# EasyEDA schematic SCH_TwoStep-OPEN-SOURCE_2024-09-30.json

## Sheets
1 Outputs: TITLE: Sheet_2; REV: 1.0; Date: 2022-02-27; Sheet: 1/1; Drawn By: Norman Alphaspeed; Company: Your Company
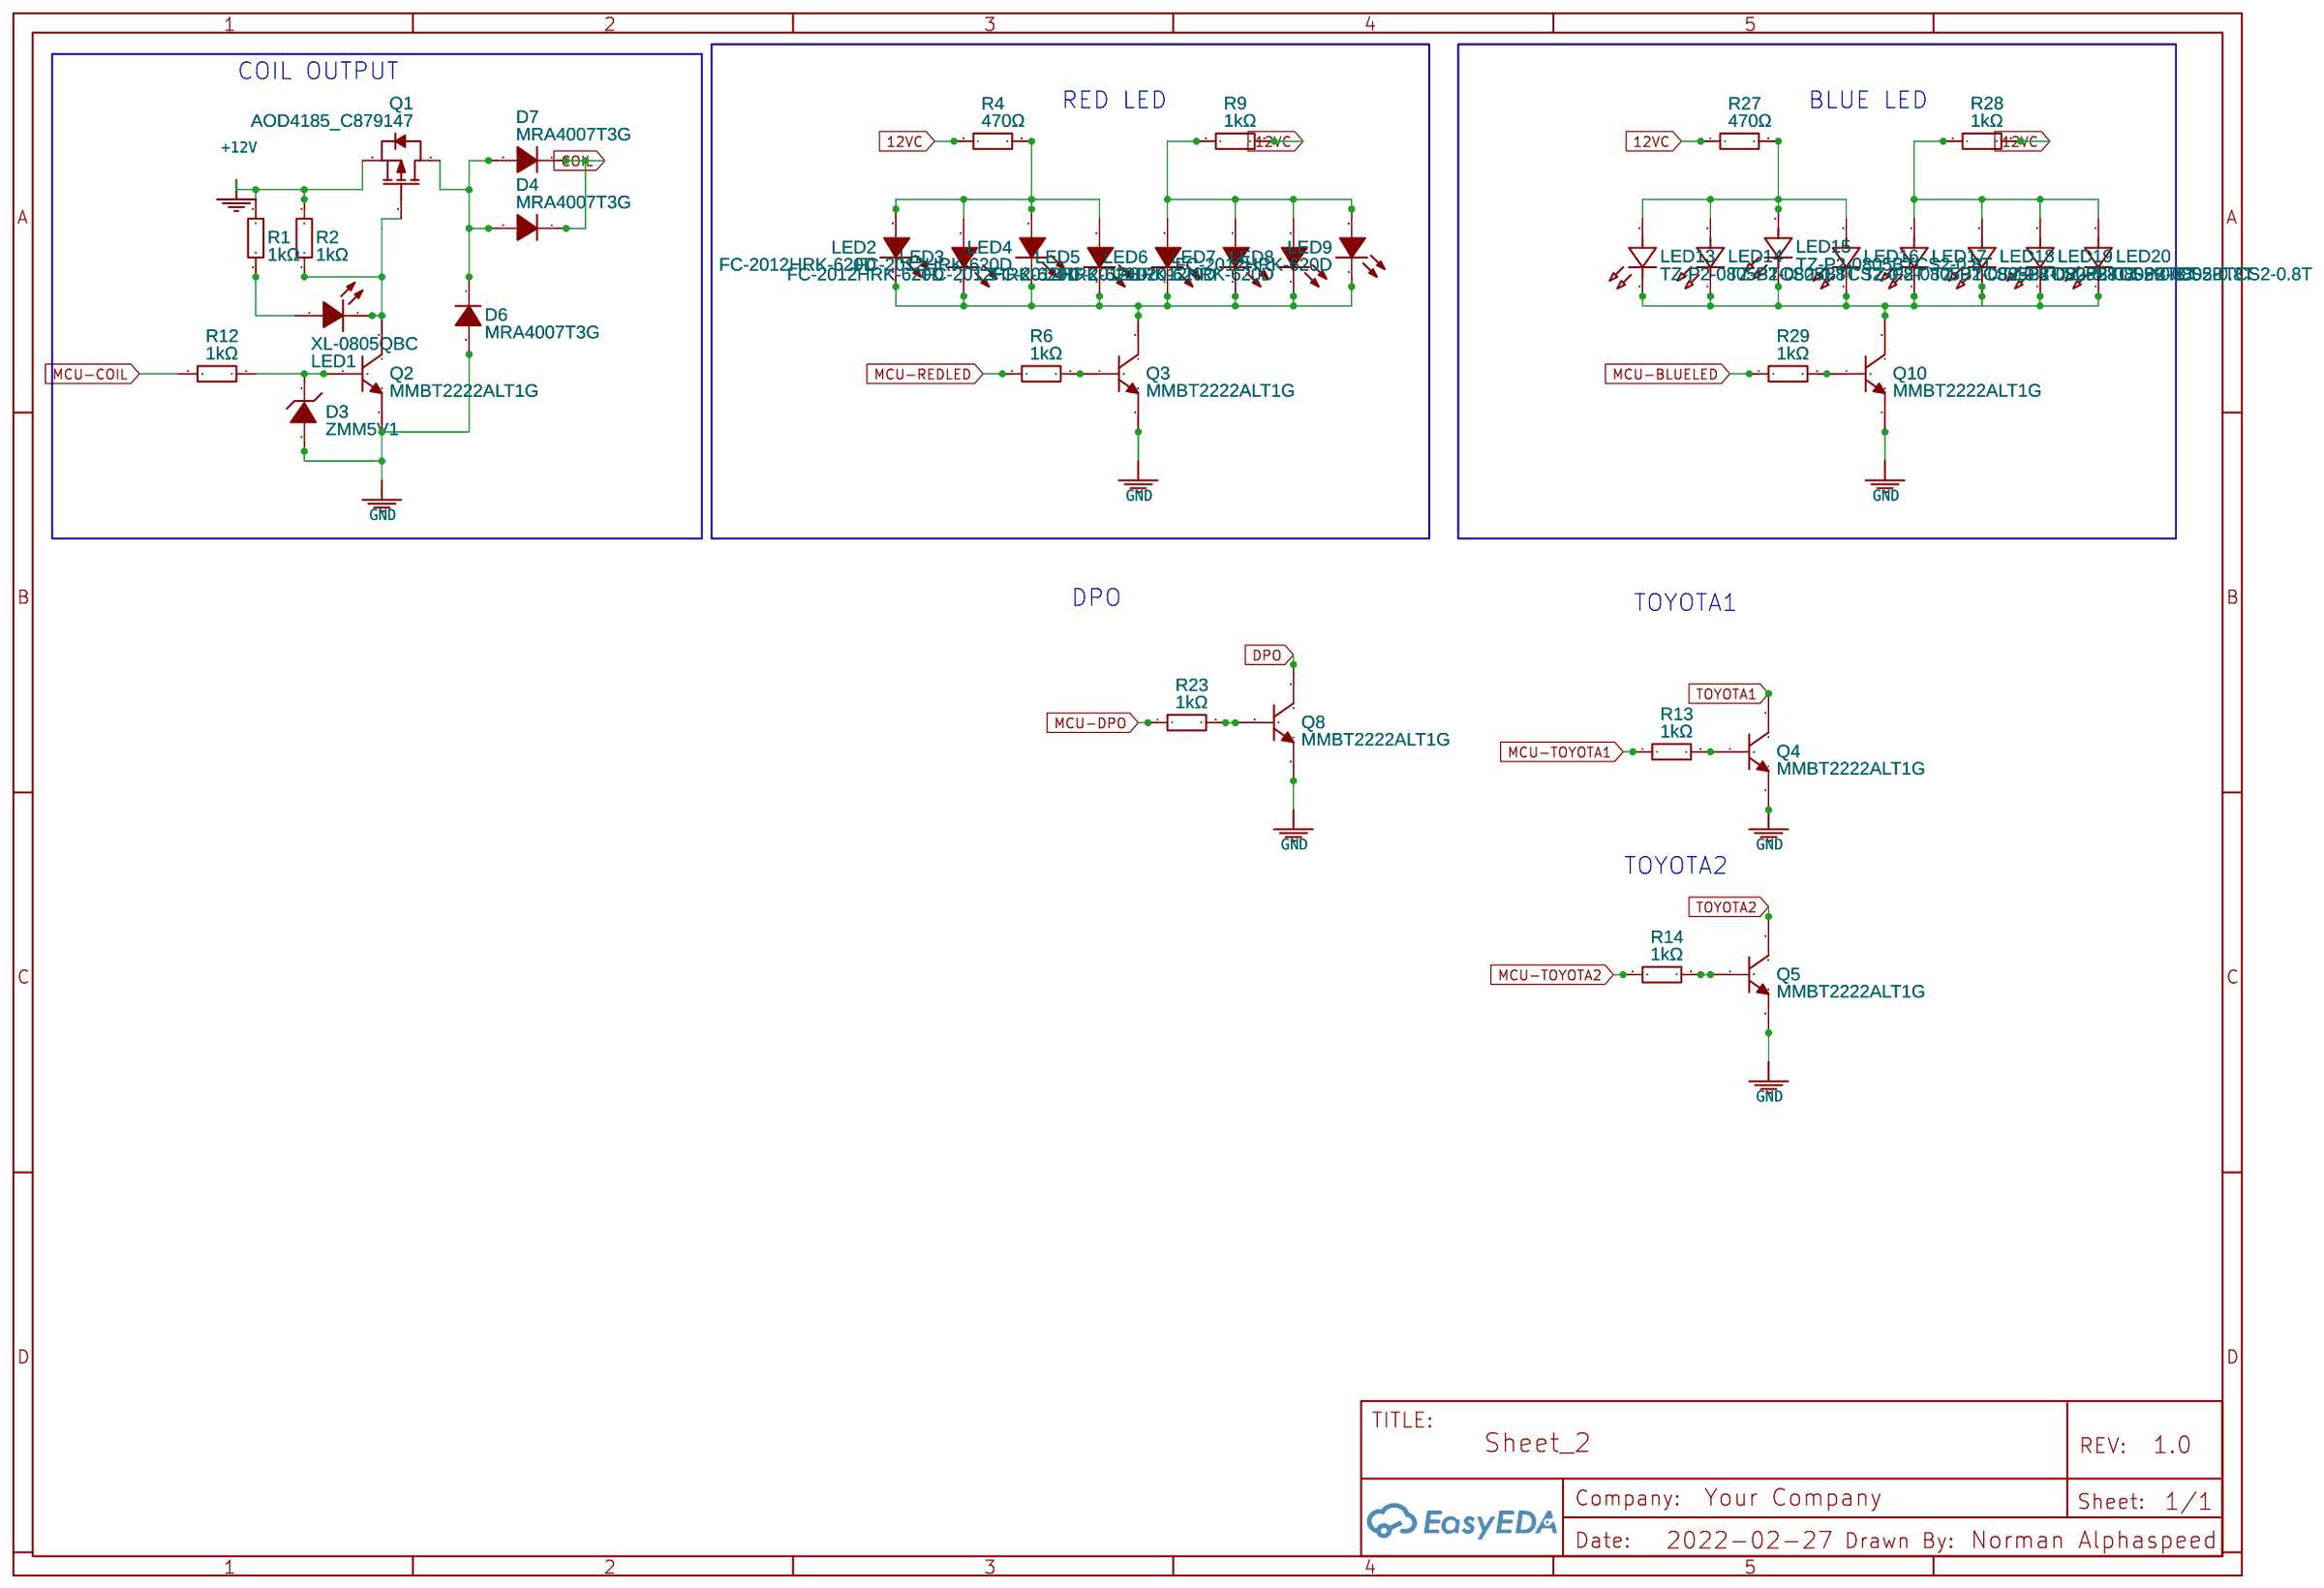
[diagram p0: Outputs]
2 Inputs: TITLE: Inputs
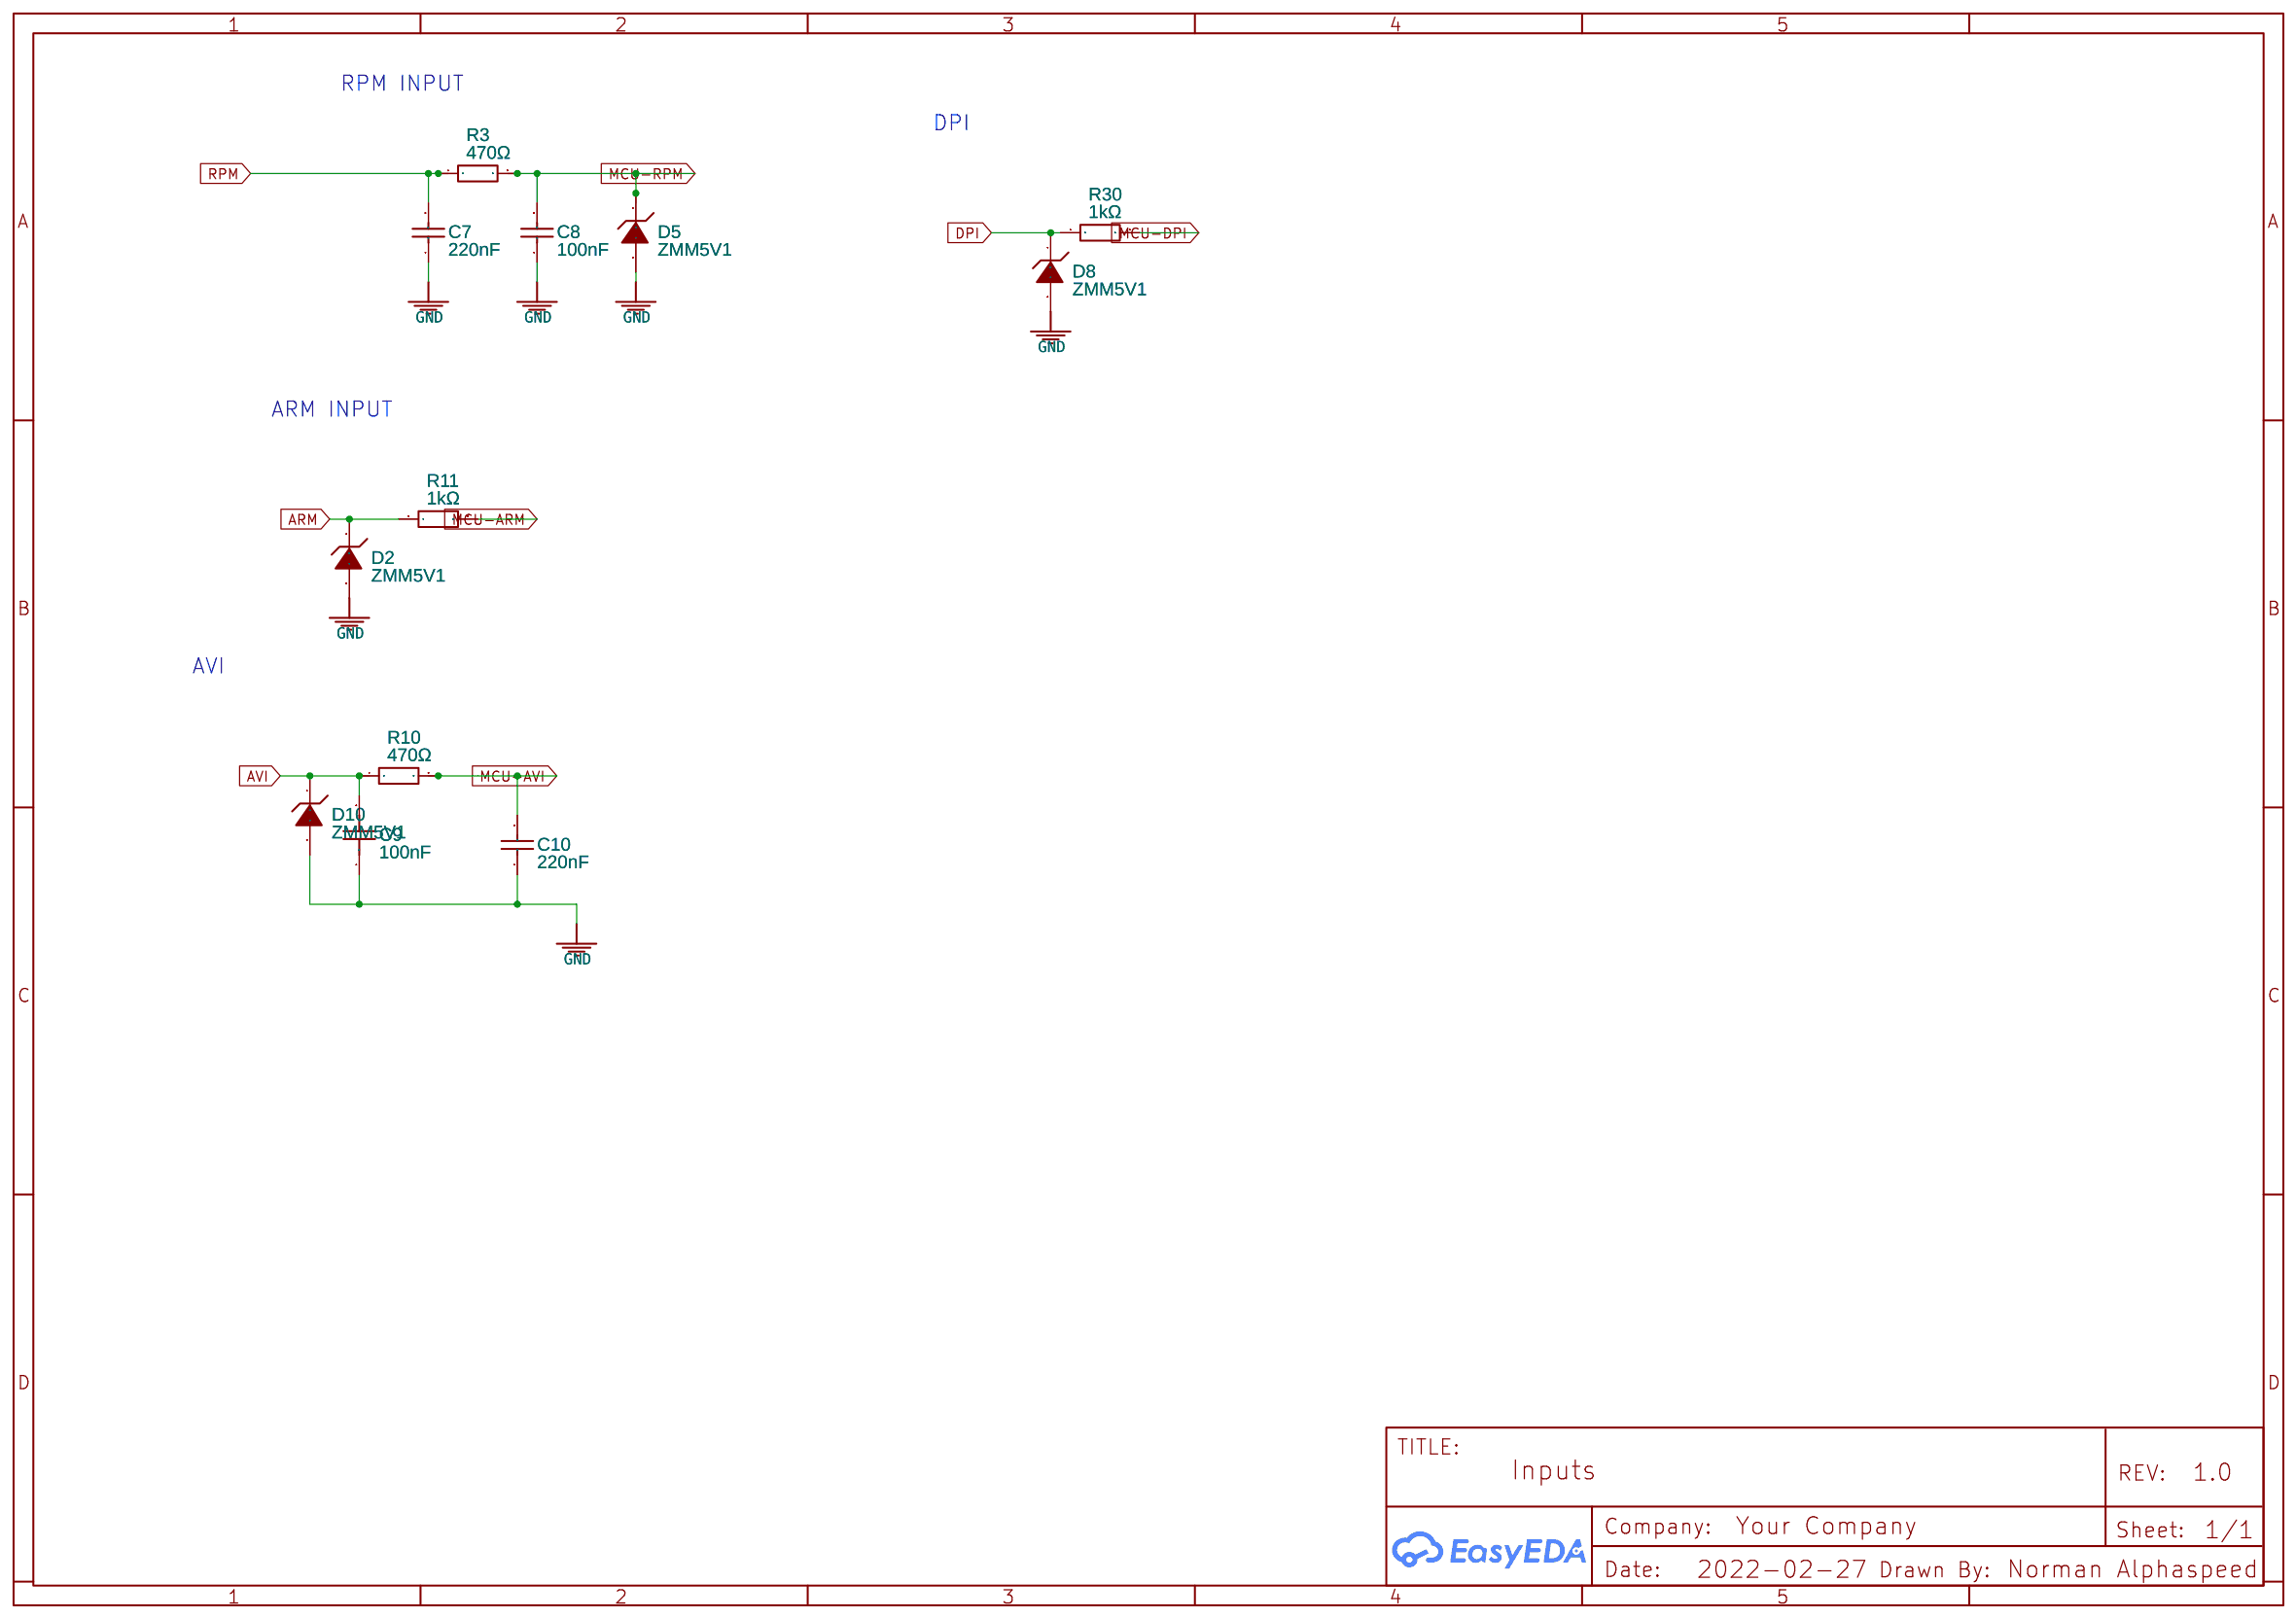
[diagram p1: Inputs]
3 MCU: TITLE: Sheet_1
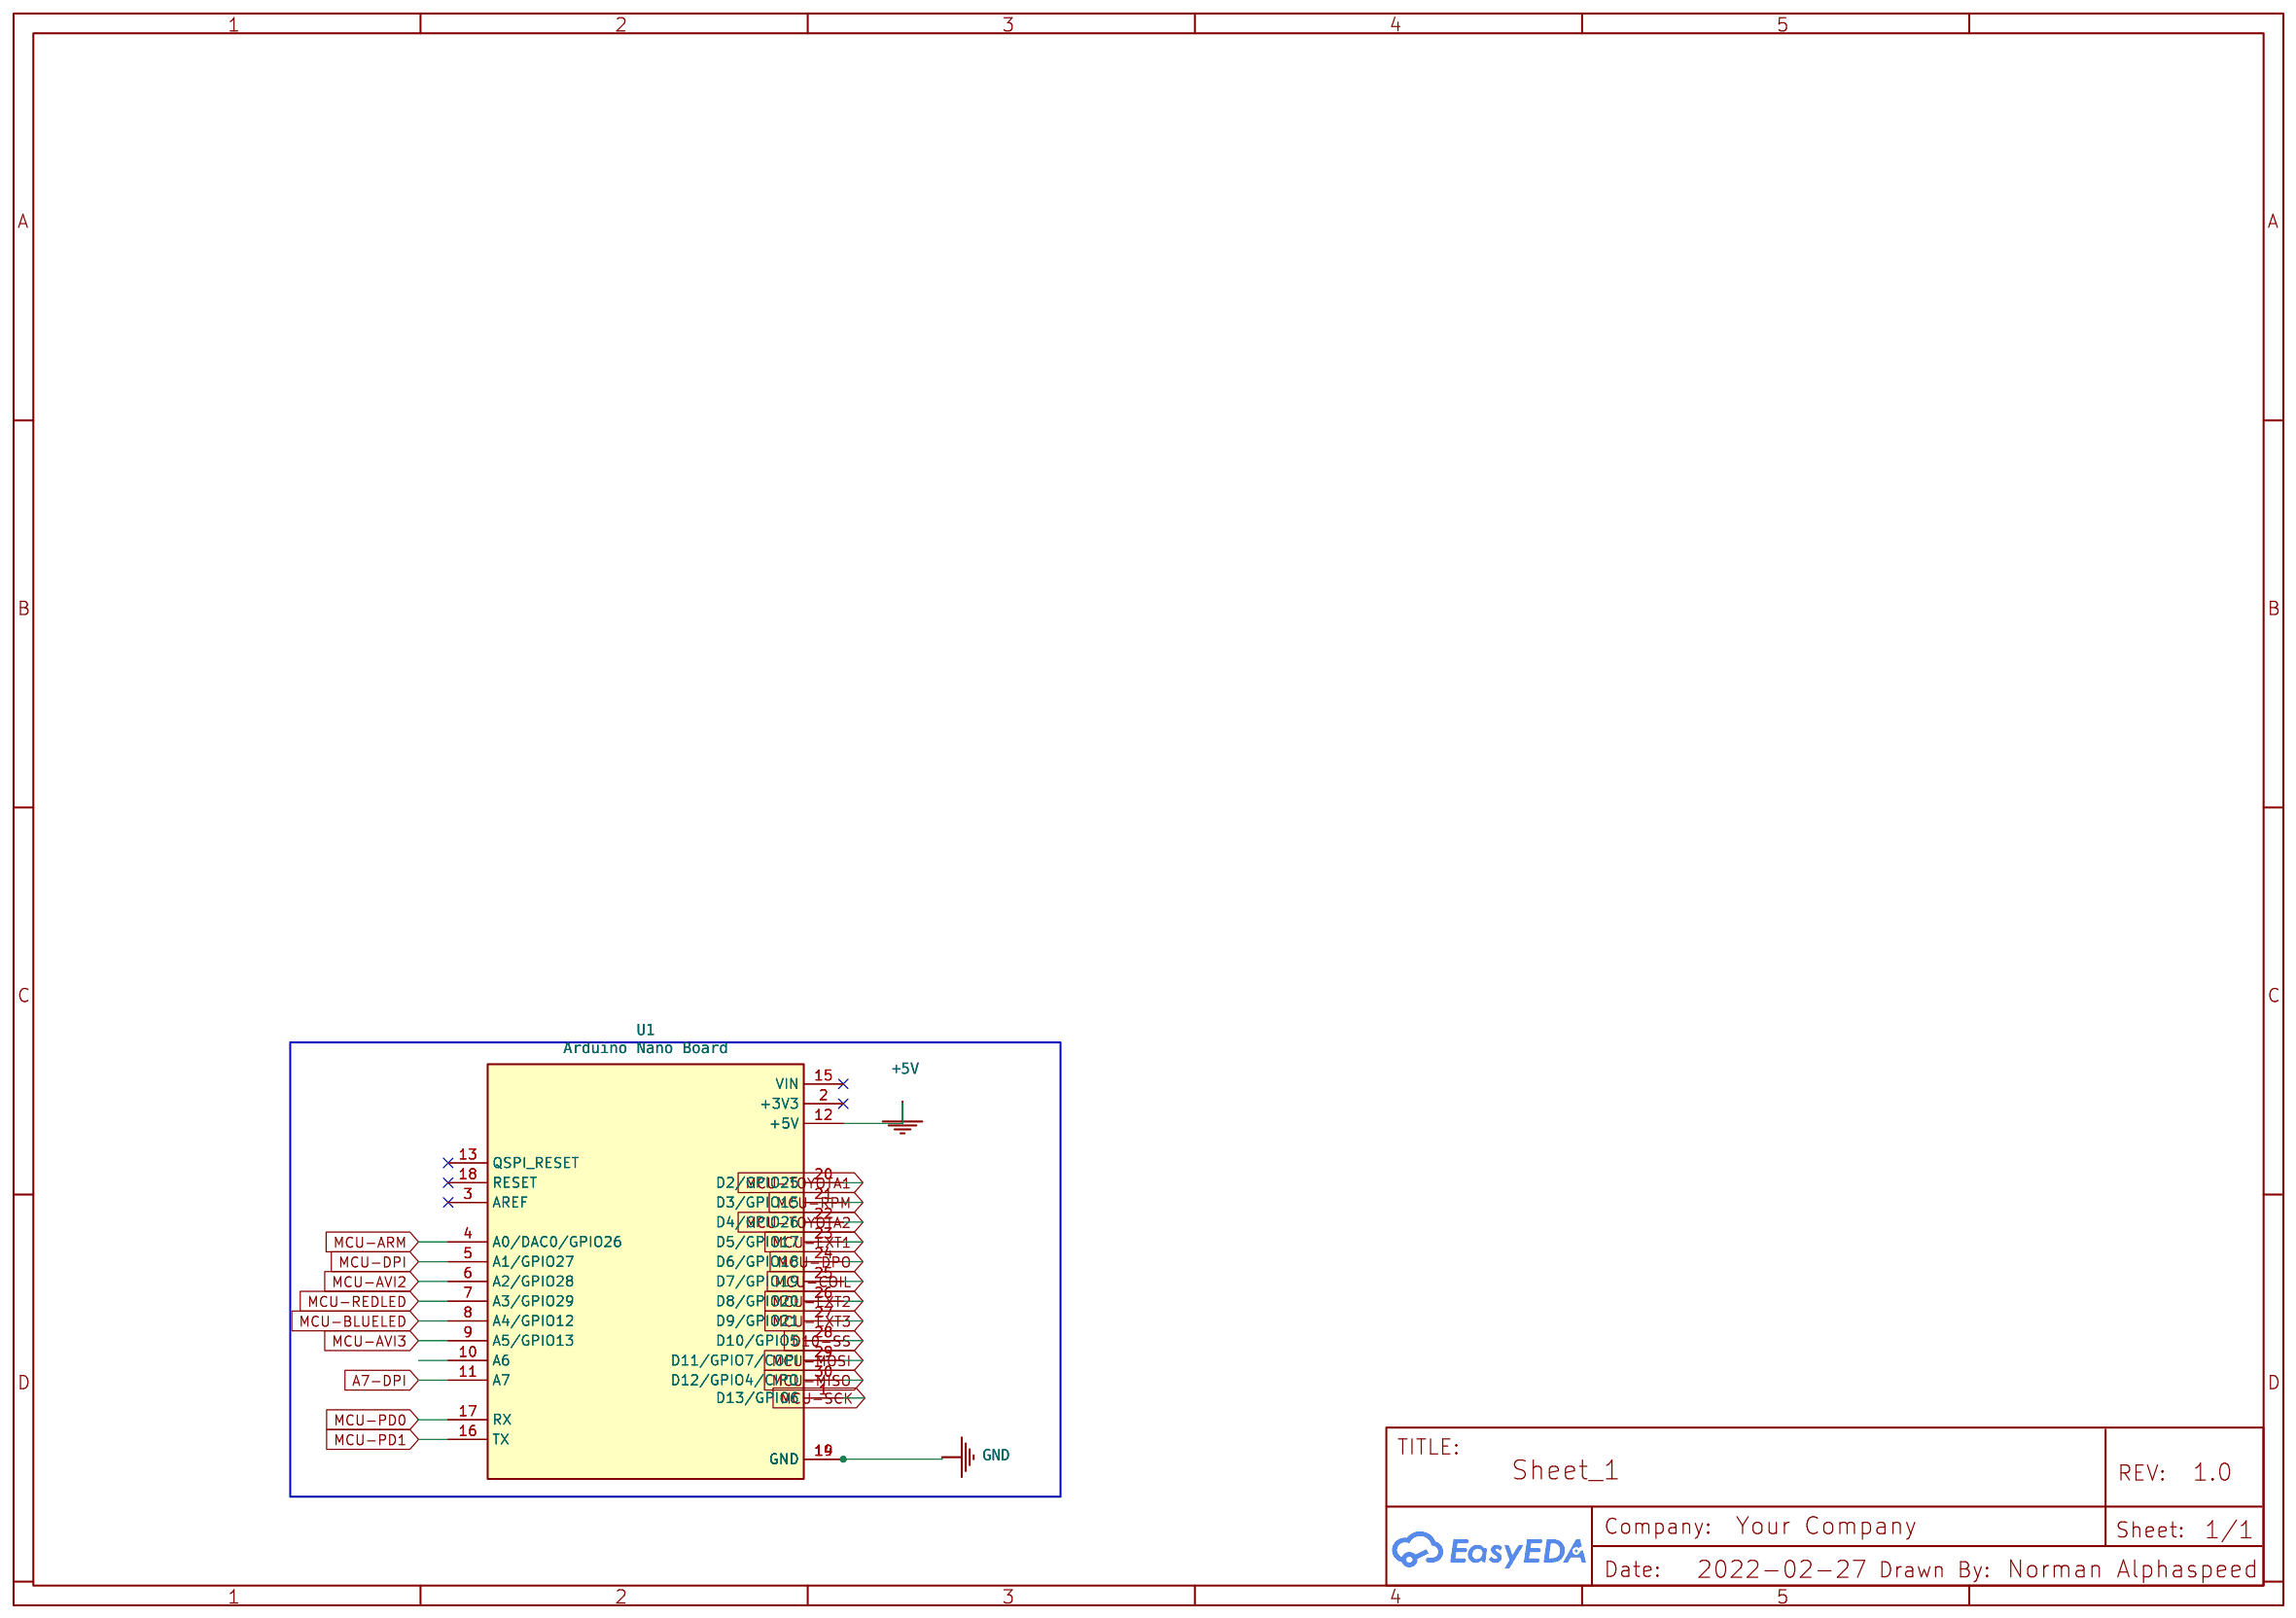
[diagram p2: MCU]
4 Comms: TITLE: Sheet_1; Date: 2022-02-28
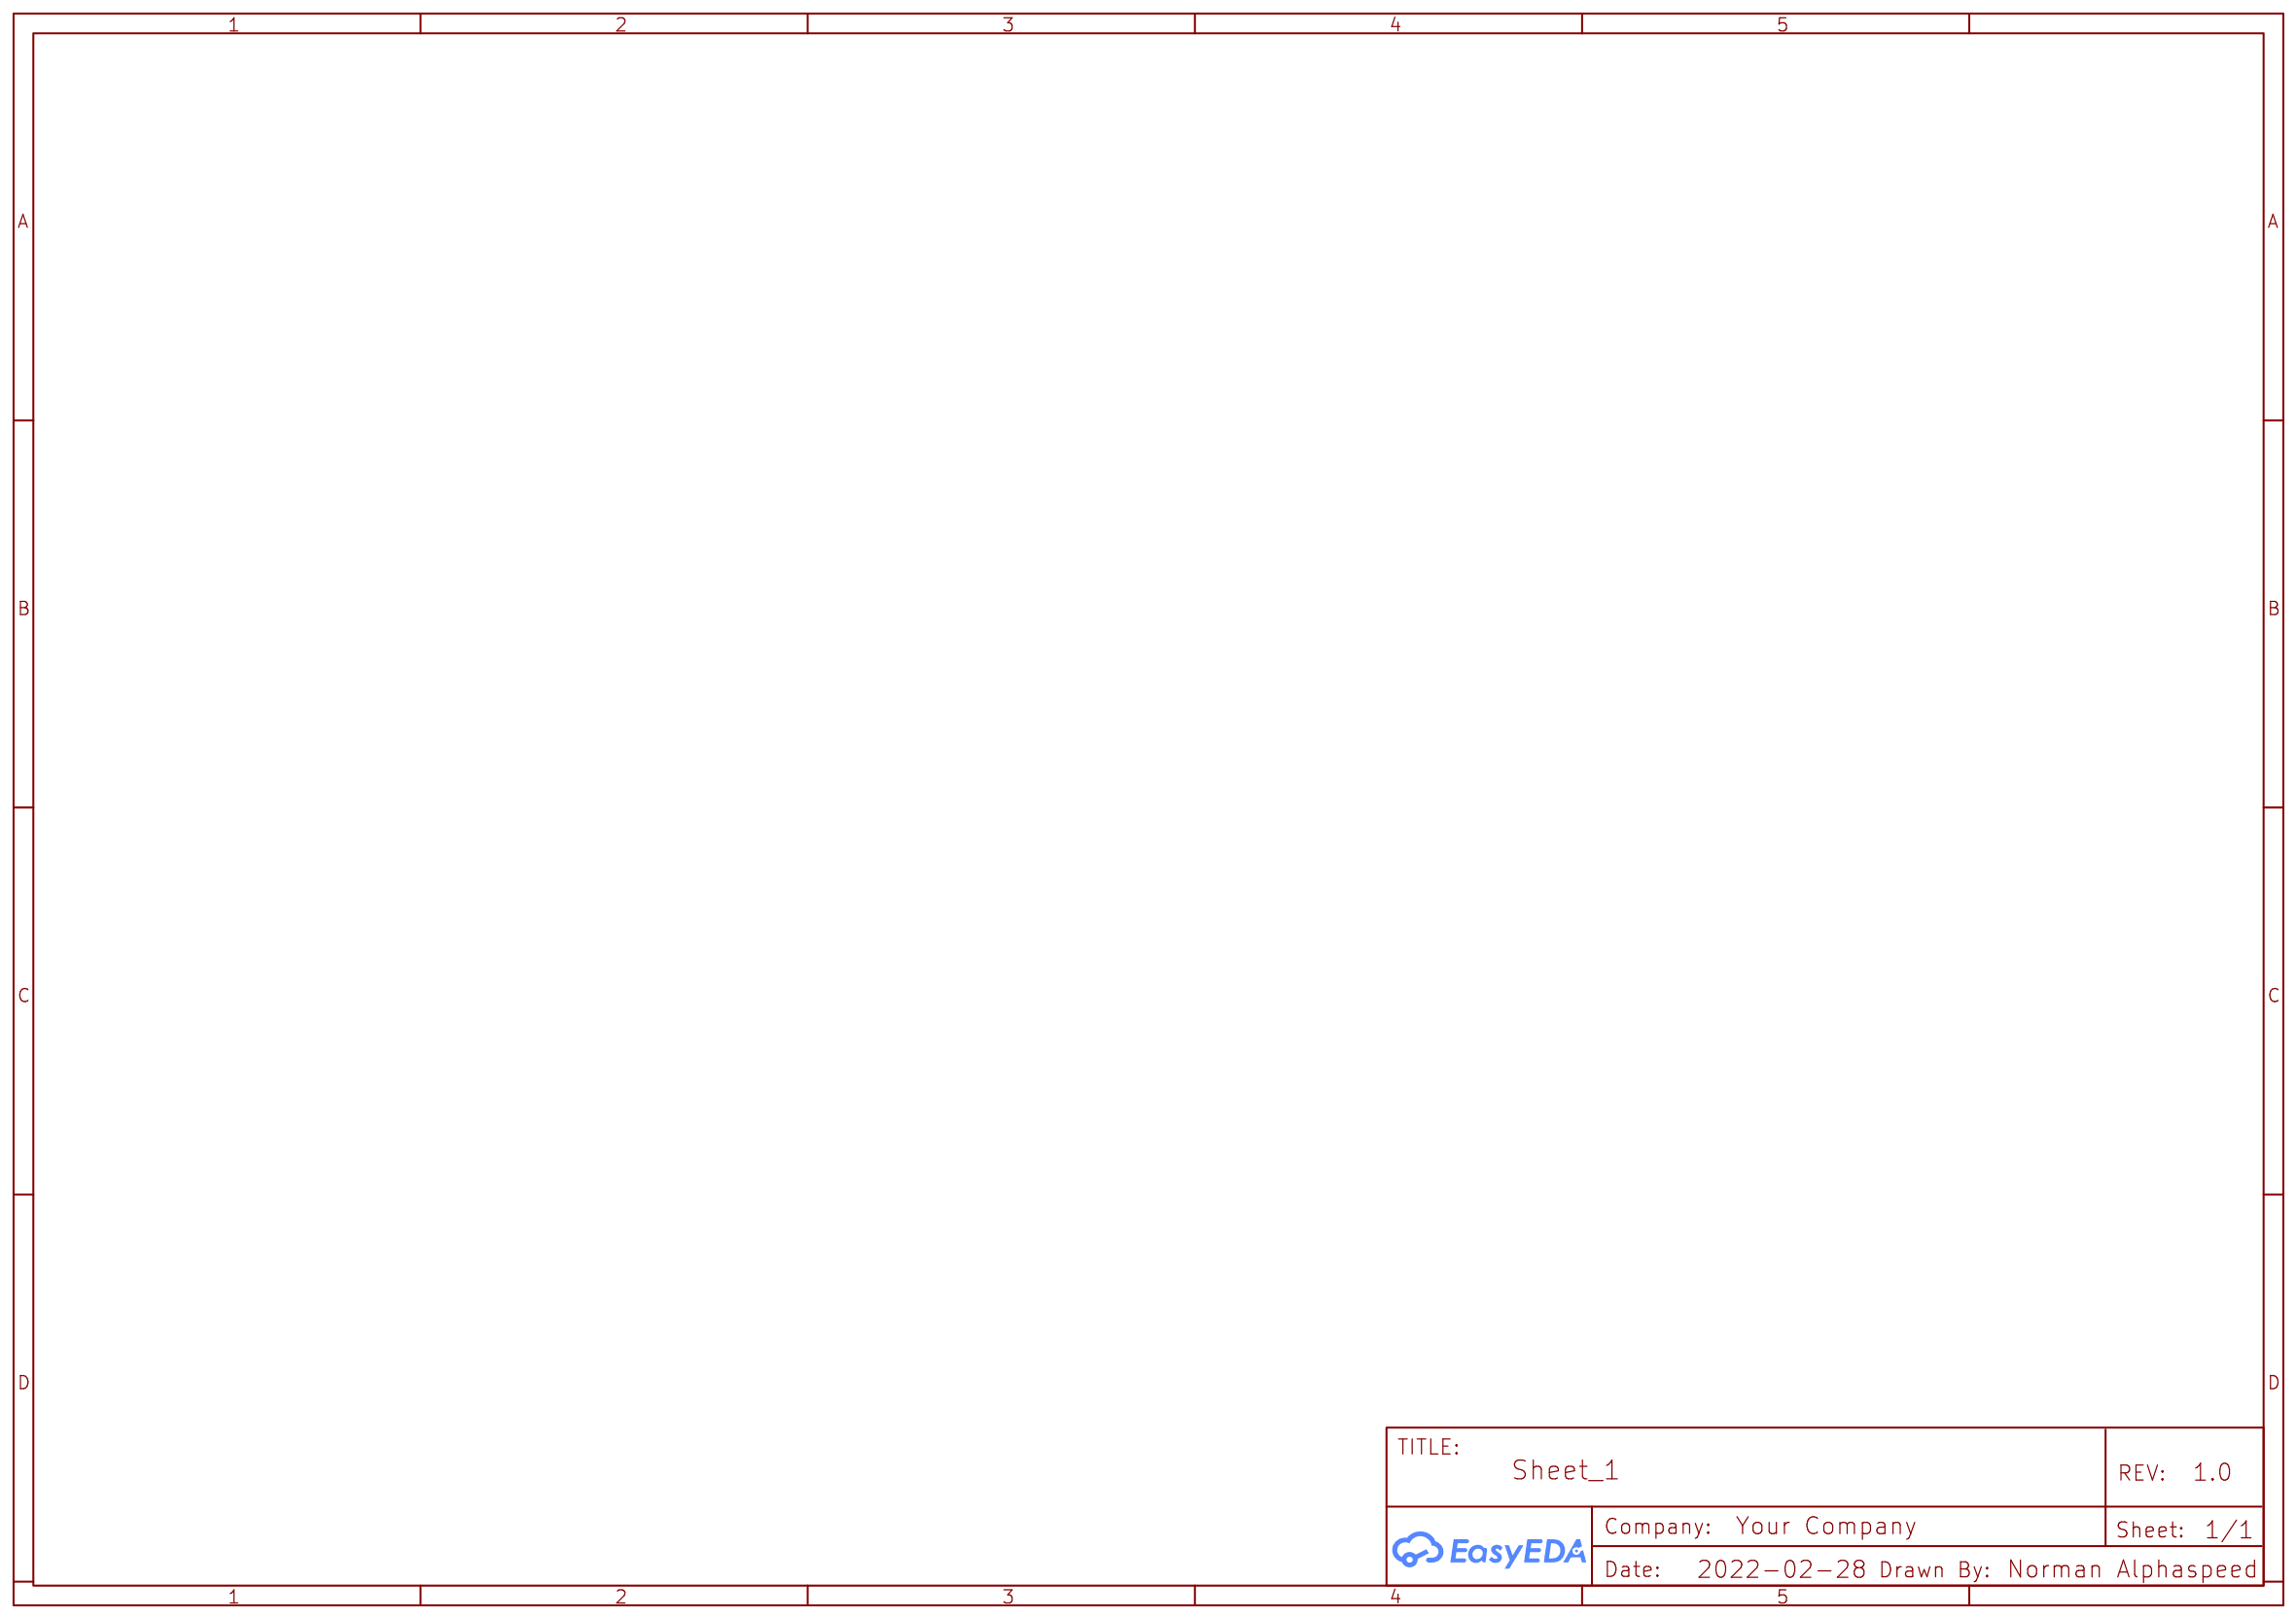
[diagram p3: Comms]
5 Connector copy copy: TITLE: SMD TwoStep Box; Date: 2022-02-26; Company: AlphaX
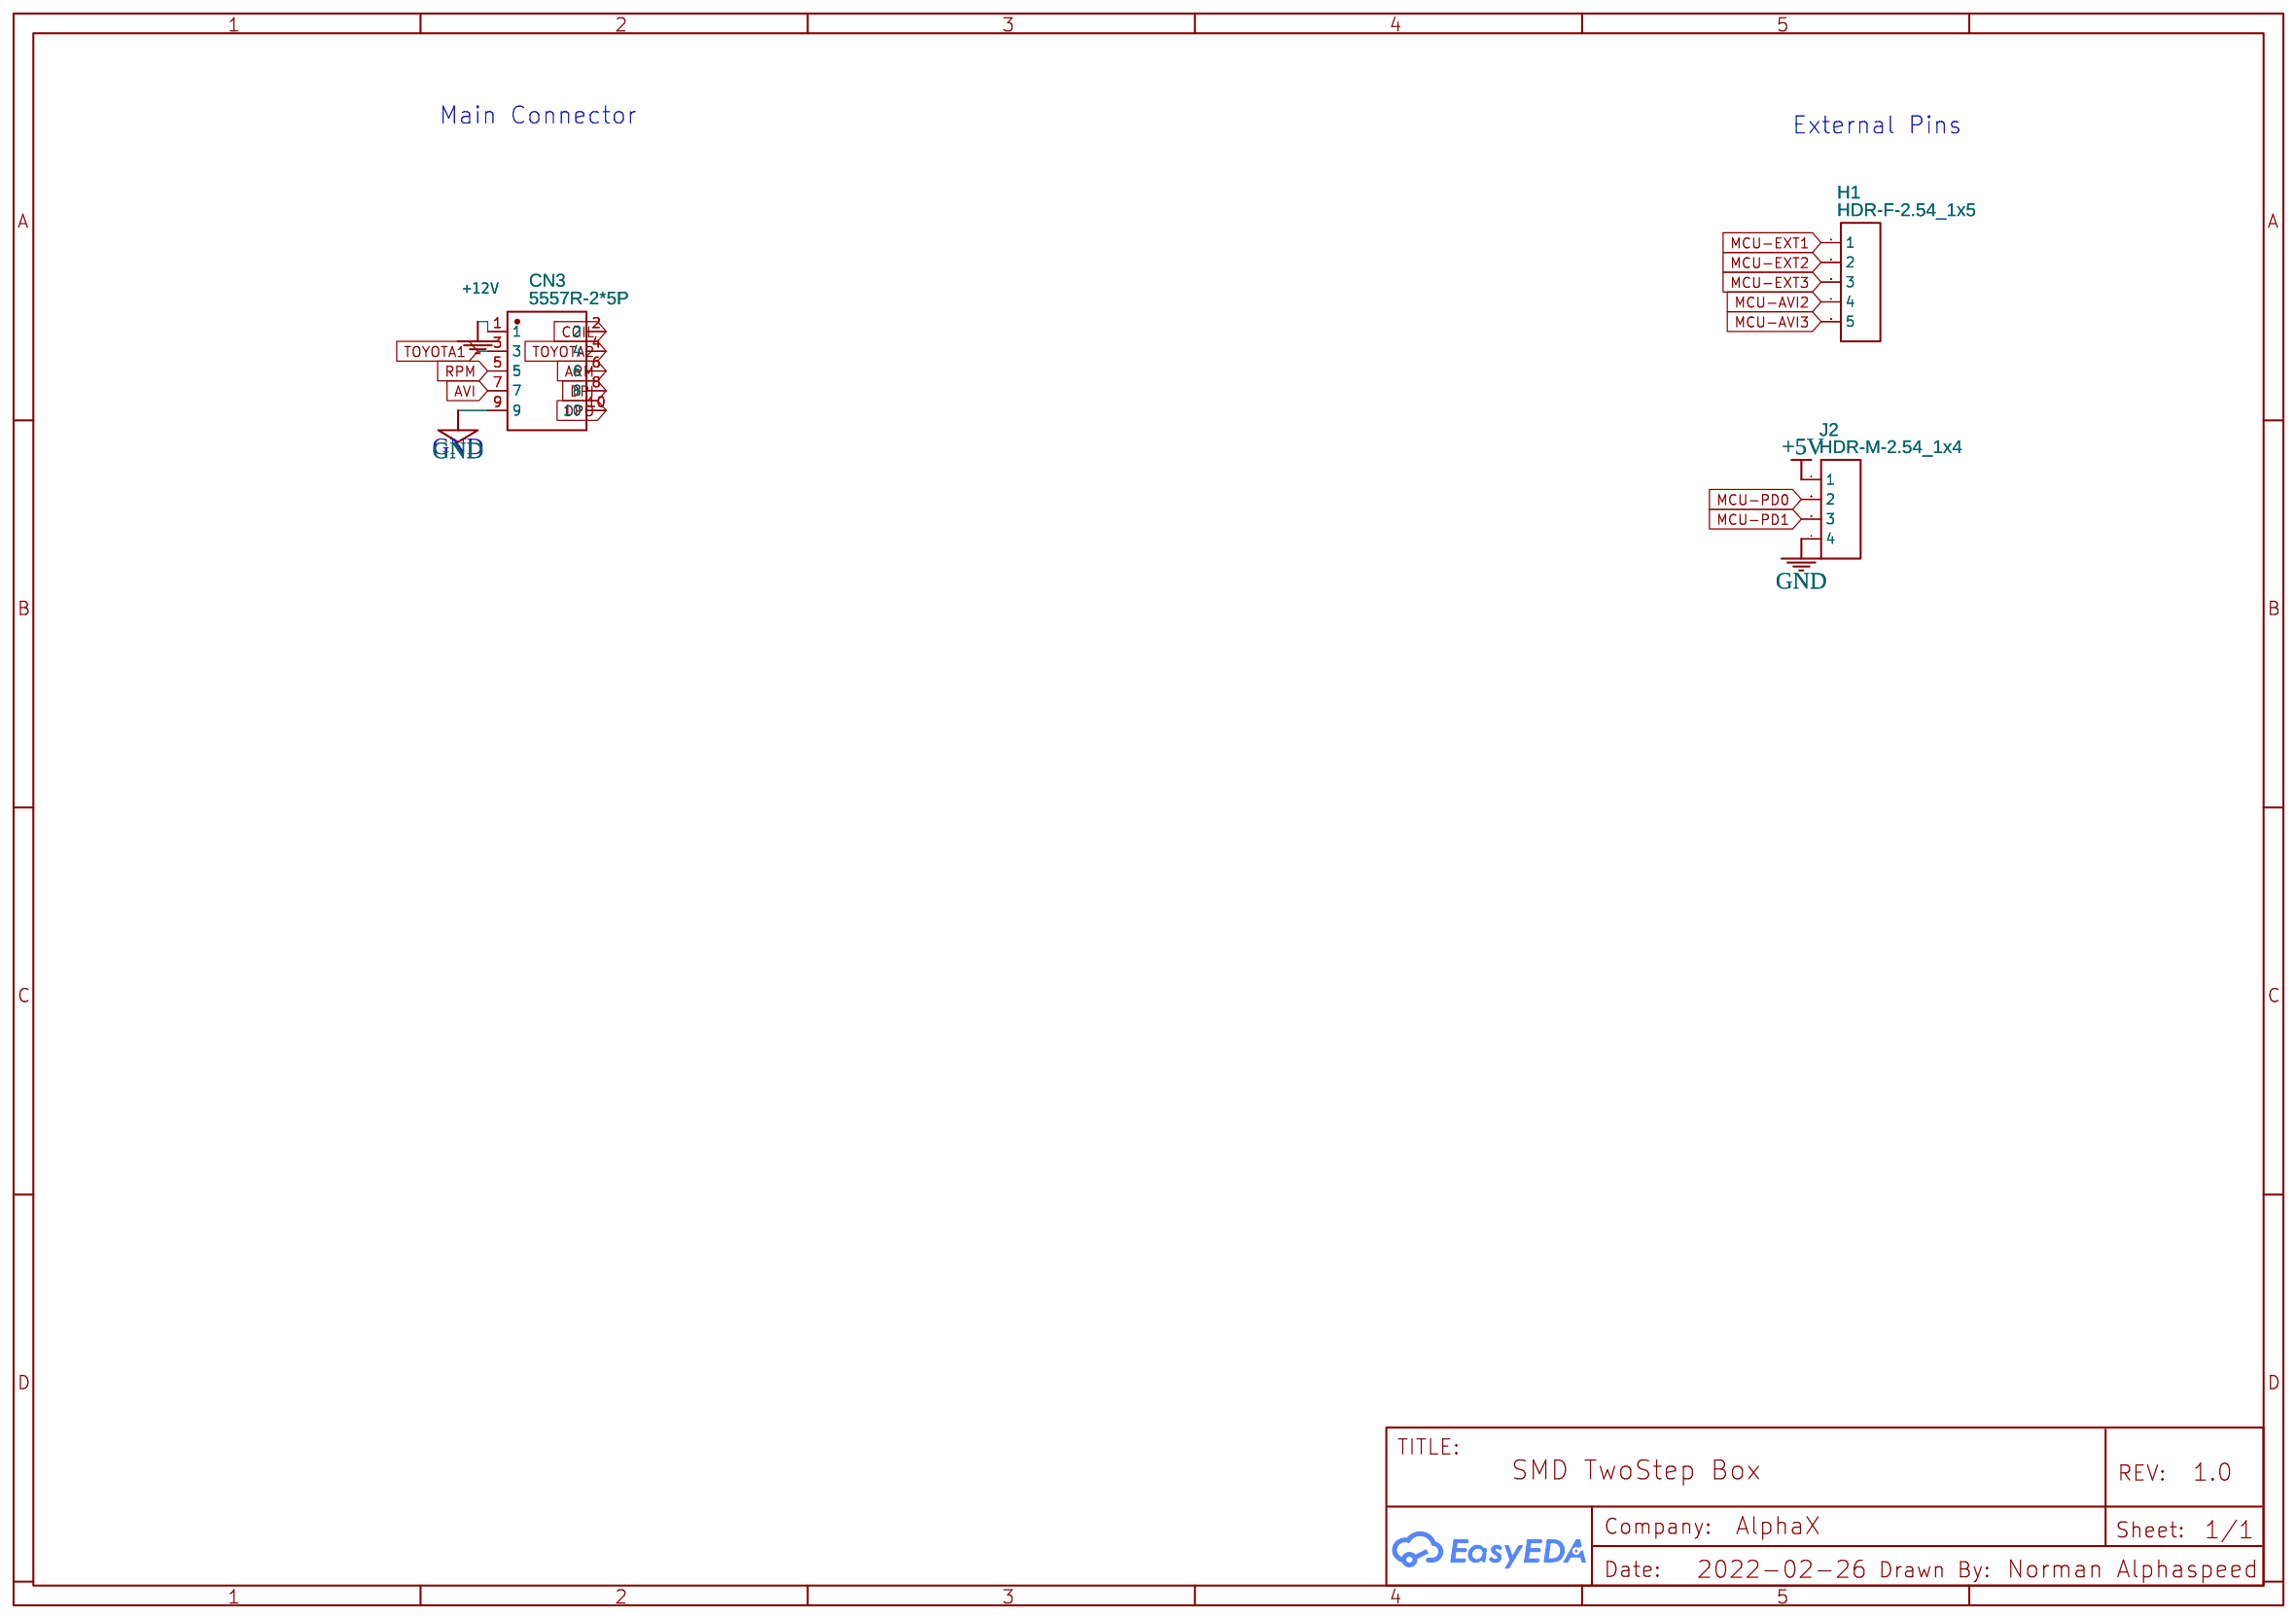
[diagram p4: Connector copy copy]
6 Power: TITLE: Sheet_1; Date: 2022-12-05
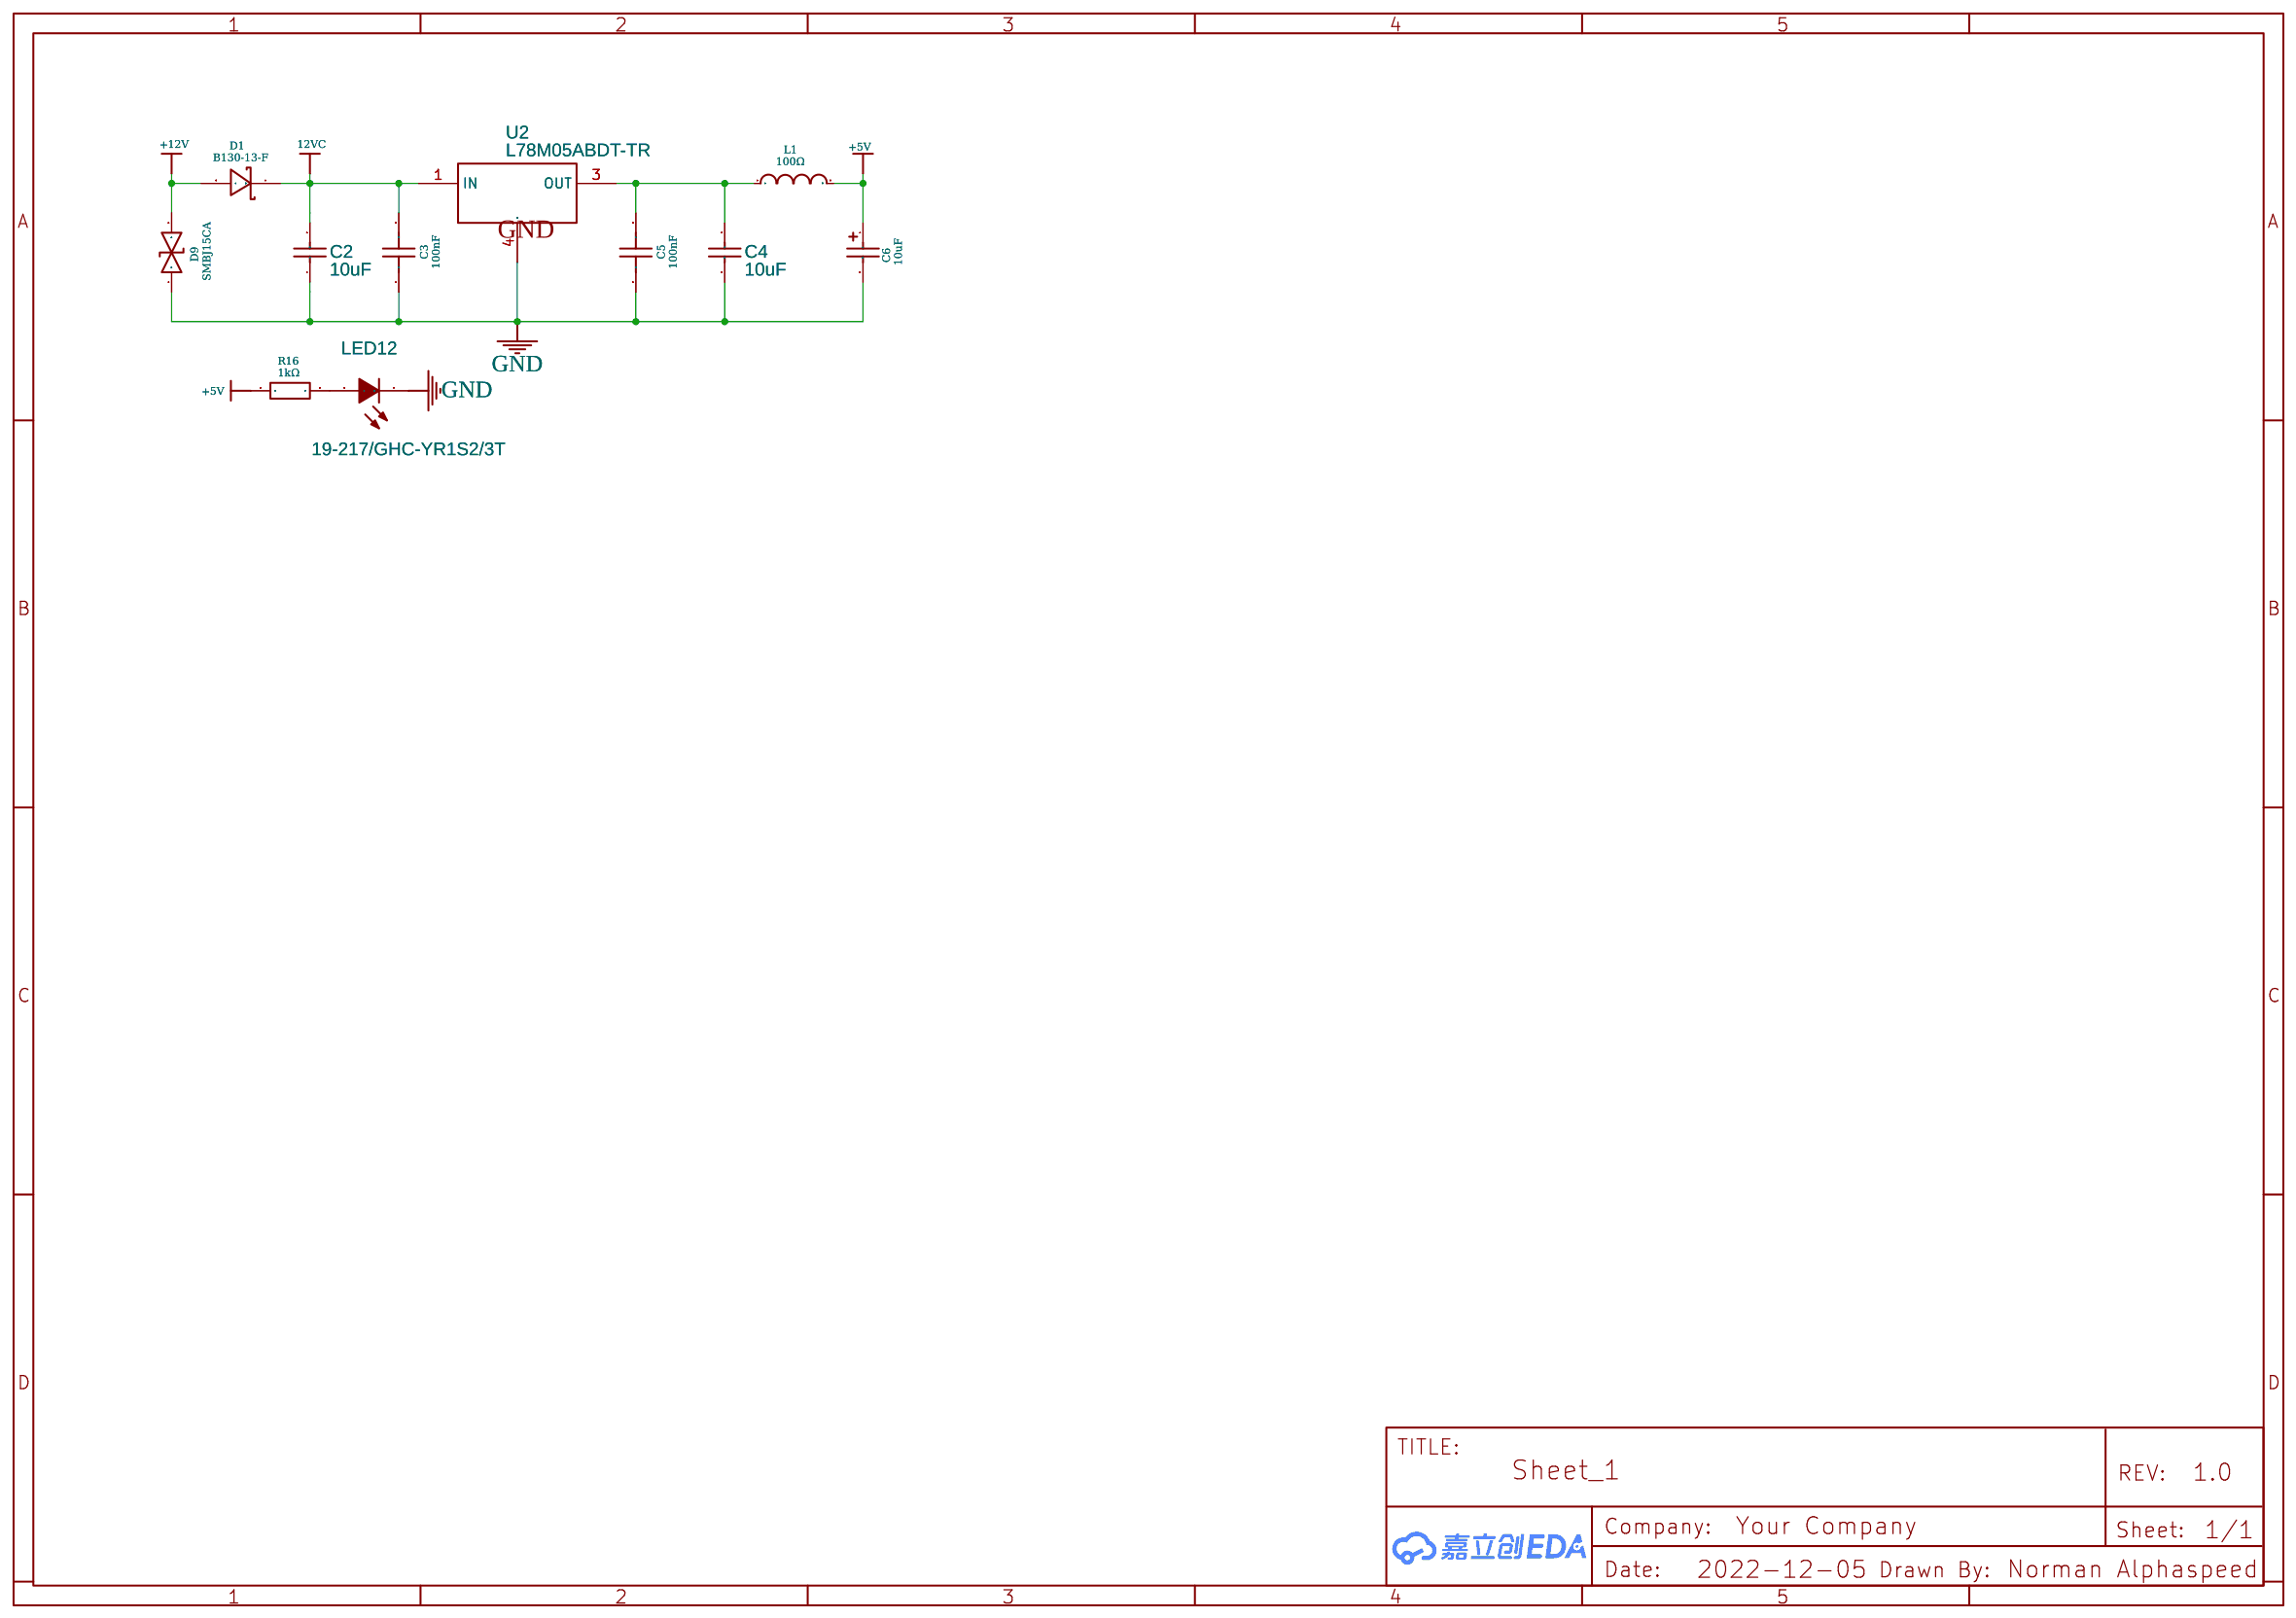
[diagram p5: Power]

## Parts
sheet Connector copy copy
CN3  5557R-2*5P  [CONN-TH_5557R-2-5P]
H1  HDR-F-2.54_1x5  [HDR-F-2.54_1X5]
J2  HDR-M-2.54_1x4  [HDR-M-2.54_1X4]
sheet Inputs
C7  220nF  [C0805]
C8  100nF  [C0805]
C9  100nF  [C0603]
C10  220nF  [C0603]
D2  ZMM5V1  [LL-34_L3.5-W1.5-RD]
D5  ZMM5V1  [LL-34_L3.5-W1.5-RD]
D8  ZMM5V1  [LL-34_L3.5-W1.5-RD]
D10  ZMM5V1  [LL-34_L3.5-W1.5-RD]
R3  470Ω  [R0805]
R10  470Ω  [R0805]
R11  1kΩ  [R0603]
R30  1kΩ  [R0603]
sheet MCU
U1  Arduino Nano Board  [MODULE_ABX00053]
sheet Outputs
D3  ZMM5V1  [LL-34_L3.5-W1.5-RD]
D4  MRA4007T3G  [SMA_L4.3-W2.6-LS5.2-RD]
D6  MRA4007T3G  [SMA_L4.3-W2.6-LS5.2-RD]
D7  MRA4007T3G  [SMA_L4.3-W2.6-LS5.2-RD]
LED1  XL-0805QBC  [LED0805-RD]
LED2  FC-2012HRK-620D  [LED0805-RD_RED]
LED3  FC-2012HRK-620D  [LED0805-RD_RED]
LED4  FC-2012HRK-620D  [LED0805-RD_RED]
LED5  FC-2012HRK-620D  [LED0805-RD_RED]
LED6  FC-2012HRK-620D  [LED0805-RD_RED]
LED7  FC-2012HRK-620D  [LED0805-RD_RED]
LED8  FC-2012HRK-620D  [LED0805-RD_RED]
LED9  FC-2012HRK-620D  [LED0805-RD_RED]
LED13  TZ-P2-0805BTCS2-0.8T  [LED0805-RD_BLUE]
LED14  TZ-P2-0805BTCS2-0.8T  [LED0805-RD_BLUE]
LED15  TZ-P2-0805BTCS2-0.8T  [LED0805-RD_BLUE]
LED16  TZ-P2-0805BTCS2-0.8T  [LED0805-RD_BLUE]
LED17  TZ-P2-0805BTCS2-0.8T  [LED0805-RD_BLUE]
LED18  TZ-P2-0805BTCS2-0.8T  [LED0805-RD_BLUE]
LED19  TZ-P2-0805BTCS2-0.8T  [LED0805-RD_BLUE]
LED20  TZ-P2-0805BTCS2-0.8T  [LED0805-RD_BLUE]
Q1  AOD4185_C879147  [TO-252-2_L6.6-W6.1-P4.58-LS9.9-BR]
Q2  MMBT2222ALT1G  [SOT-23-3_L2.9-W1.3-P1.90-LS2.4-BR]
Q3  MMBT2222ALT1G  [SOT-23-3_L2.9-W1.3-P1.90-LS2.4-BR]
Q4  MMBT2222ALT1G  [SOT-23-3_L2.9-W1.3-P1.90-LS2.4-BR]
Q5  MMBT2222ALT1G  [SOT-23-3_L2.9-W1.3-P1.90-LS2.4-BR]
Q8  MMBT2222ALT1G  [SOT-23-3_L2.9-W1.3-P1.90-LS2.4-BR]
Q10  MMBT2222ALT1G  [SOT-23-3_L2.9-W1.3-P1.90-LS2.4-BR]
R1  1kΩ  [R0603]
R2  1kΩ  [R0603]
R4  470Ω  [R0805]
R6  1kΩ  [R0603]
R9  1kΩ  [R0603]
R12  1kΩ  [R0603]
R13  1kΩ  [R0603]
R14  1kΩ  [R0603]
R23  1kΩ  [R0603]
R27  470Ω  [R0805]
R28  1kΩ  [R0603]
R29  1kΩ  [R0603]
sheet Power
C2  10uF  [C1206]
C3  100nF  [C0603]
C4  10uF  [C1206]
C5  100nF  [C0603]
C6  10uF  [CAP-SMD_L3.2-W1.6-RD-C7171]
D1  B130-13-F  [SMA_L4.3-W2.6-LS5.2-RD]
D9  SMBJ15CA  [SMB_L4.6-W3.6-LS5.3-BI]
L1  100Ω  [L0805]
LED12  19-217/GHC-YR1S2/3T  [LED0603-RD]
R16  1kΩ  [R0402]
U2  L78M05ABDT-TR  [TO-252-2_L6.5-W6.1-P4.58-LS10.0-TL]

## Library data of the parts
CN3 = 5557R-2*5P: Supplier: LCSC; Manufacturer: Ckmtw; Contributor: LCSC; Supplier Part: C169049; JLCPCB Part Class: Extended Part
H1 = HDR-F-2.54_1x5: Supplier Part: C50950; Supplier: LCSC; Contributor: LCEDA_Lib
J2 = HDR-M-2.54_1x4: Supplier Part: C124378; Supplier: LCSC; Contributor: LCEDA_Lib
C7 = CL21B224KBFNNNE: Supplier: LCSC; Manufacturer: SAMSUNG; Supplier Part: C5378; JLCPCB Part Class: Basic Part
C8 = CC0805KRX7R9BB104: Supplier: LCSC; Manufacturer: YAGEO; Supplier Part: C49678; JLCPCB Part Class: Basic Part; Package Display: No
C3 C5 C9 = CC0603KRX7R9BB104: Supplier: LCSC; Manufacturer: YAGEO; Supplier Part: C14663; JLCPCB Part Class: Basic Part
C10 = CL10B224KA8NNNC: Supplier: LCSC; Manufacturer: SAMSUNG; Supplier Part: C21120; JLCPCB Part Class: Basic Part
D2 D3 D5 D8 D10 = ZMM5V1: Supplier: LCSC; Manufacturer: SEMTECH; Supplier Part: C8061; JLCPCB Part Class: Extended Part
R3 R4 R10 R27 = 0805W8F4700T5E: Supplier: LCSC; Manufacturer: UniOhm; Supplier Part: C17710; Resistance (Ohms): 470; JLCPCB Part Class: Basic Part
R1 R2 R6 R9 R11-R14 R23 R28-R30 = 0603WAF1001T5E: Supplier: LCSC; Manufacturer: UniOhm; Supplier Part: C21190; Resistance (Ohms): 1K; JLCPCB Part Class: Basic Part
U1 = -: MANUFACTURER: Arduino; PARTREV: Rev. 01 - 14/05/2021; STANDARD: Manufacturer Recommendations
D4 D6 D7 = MRA4007T3G: Supplier: LCSC; Manufacturer: ON; Supplier Part: C47921; JLCPCB Part Class: Extended Part
LED1 = XL-0805QBC: Supplier: LCSC; Manufacturer: KENTO; Supplier Part: C2293; JLCPCB Part Class: Basic Part
LED2-LED9 = FC-2012HRK-620D: Supplier: LCSC; Manufacturer: NATIONSTAR; Supplier Part: C84256; JLCPCB Part Class: Basic Part
LED13-LED20 = TZ-P2-0805BTCS2-0.8T: Supplier: LCSC; Supplier Part: C779459; Manufacturer: TUOZHAN; Contributor: LCSC; JLCPCB Part Class: Extended Part
Q1 = AOD4185_C879147: Supplier: LCSC; Supplier Part: C879147; Manufacturer: VBsemi Elec; Manufacturer Part: AOD4185; Contributor: LCSC; JLCPCB Part Class: Extended Part
Q2-Q5 Q8 Q10 = MMBT2222ALT1G: Supplier: LCSC; Manufacturer: ON; Supplier Part: C82460; JLCPCB Part Class: Extended Part
C2 C4 = CL31A106KBHNNNE: Supplier: LCSC; Manufacturer: SAMSUNG; Supplier Part: C13585; JLCPCB Part Class: Basic Part
C6 = TAJA106K016RNJ: Supplier: LCSC; Manufacturer: AVX; Supplier Part: C7171; JLCPCB Part Class: Basic Part
D1 = B130-13-F: Supplier Part: C134423; Supplier: LCSC; Manufacturer: DIODES; Contributor: LCSC; JLCPCB Part Class: Extended Part
D9 = SMBJ15CA-C113989: Supplier: LCSC; Manufacturer: MDD; Supplier Part: C113989; JLCPCB Part Class: Extended Part
L1 = GZ2012D101TF: Supplier: LCSC; Manufacturer: Sunlord; Supplier Part: C1015; JLCPCB Part Class: Basic Part
LED12 = 19-217/GHC-YR1S2/3T: Supplier: LCSC; Manufacturer: EVERLIGHT(亿光); Supplier Part: C72043; JLCPCB Part Class: Basic Part
R16 = 0402WGF1001TCE: Supplier: LCSC; Manufacturer: UniOhm; Supplier Part: C11702; Resistance (Ohms): 1K; JLCPCB Part Class: Basic Part
U2 = L78M05ABDT-TR: Supplier: LCSC; Manufacturer: STMicroelectronics; Supplier Part: C58069; JLCPCB Part Class: Basic Part

## Nets
12VC: C2.2 C3.2 D1.1(C) R4.1 R9.2 R27.1 R28.2 U2.1(IN)
+5V: C6.1 J2.1 L1.2 R16.1 U1.12(+5V)
+12V: CN3.1 D1.2(A) D9.2 Q1.3(S) R1.2 R2.2
GND: C2.1 C3.1 C4.1 C5.1 C6.2 C7.1 C8.1 C9.1 C10.1 CN3.9 D2.2(A) D3.2(A) D5.2(A) D6.2(A) D8.2(A) D9.1 D10.2(A) J2.4 LED12.1(C) Q2.2(E) Q3.2(E) Q4.2(E) Q5.2(E) Q8.2(E) Q10.2(E) U1.14(GND) U1.19(GND) U2.4(GND)
A7-DPI: U1.11(A7)
ARM: CN3.6 D2.1(C) R11.1
AVI: C9.2 CN3.7 D10.1(C) R10.1
COIL: CN3.2 D4.1(C) D7.1(C)
D10-SS: U1.28(D10/GPIO5)
DPI: CN3.8 D8.1(C) R30.1
DPO: CN3.10 Q8.3(C)
MCU-ARM: R11.2 U1.4(A0/DAC0/GPIO26)
MCU-AVI: C10.2 R10.2
MCU-AVI2: H1.4 U1.6(A2/GPIO28)
MCU-AVI3: H1.5 U1.9(A5/GPIO13)
MCU-BLUELED: R29.1 U1.8(A4/GPIO12)
MCU-COIL: R12.2 U1.25(D7/GPIO19)
MCU-DPI: R30.2 U1.5(A1/GPIO27)
MCU-DPO: R23.1 U1.24(D6/GPIO18)
MCU-EXT1: H1.1 U1.23(D5/GPIO17)
MCU-EXT2: H1.2 U1.26(D8/GPIO20)
MCU-EXT3: H1.3 U1.27(D9/GPIO21)
MCU-MISO: U1.30(D12/GPIO4/CIPO)
MCU-MOSI: U1.29(D11/GPIO7/COPI)
MCU-PD0: J2.2 U1.17(RX)
MCU-PD1: J2.3 U1.16(TX)
MCU-REDLED: R6.1 U1.7(A3/GPIO29)
MCU-RPM: C8.2 D5.1(C) R3.2 U1.21(D3/GPIO15)
MCU-SCK: U1.1(D13/GPIO6)
MCU-TOYOTA1: R13.1 U1.20(D2/GPIO25)
MCU-TOYOTA2: R14.1 U1.22(D4/GPIO26)
RPM: C7.2 CN3.5 R3.1
TOYOTA1: CN3.3 Q4.3(C)
TOYOTA2: CN3.4 Q5.3(C)
Net-(C4-2): C4.2 C5.2 L1.1 U2.3(OUT)
Net-(D3-1): D3.1(C) Q2.1(B) R12.1
Net-(D4-2): D4.2(A) D6.1(C) D7.2(A) Q1.2(D)
Net-(LED1-1): LED1.1(K) Q1.1(G) Q2.3(C) R2.1
Net-(LED1-2): LED1.2(A) R1.1
Net-(LED2-1): LED2.1(-) LED3.1(-) LED4.1(-) LED5.1(-) LED6.1(-) LED7.1(-) LED8.1(-) LED9.1(-) Q3.3(C)
Net-(LED2-2): LED2.2(+) LED3.2(+) LED4.2(+) LED5.2(+) R4.2
Net-(LED6-2): LED6.2(+) LED7.2(+) LED8.2(+) LED9.2(+) R9.1
Net-(LED12-2): LED12.2(A) R16.2
Net-(LED13-1): LED13.1(-) LED14.1(-) LED15.1(-) LED16.1(-) LED17.1(-) LED18.1(-) LED19.1(-) LED20.1(-) Q10.3(C)
Net-(LED13-2): LED13.2(+) LED14.2(+) LED15.2(+) LED16.2(+) R27.2
Net-(LED17-2): LED17.2(+) LED18.2(+) LED19.2(+) LED20.2(+) R28.1
Net-(Q3-1): Q3.1(B) R6.2
Net-(Q4-1): Q4.1(B) R13.2
Net-(Q5-1): Q5.1(B) R14.2
Net-(Q8-1): Q8.1(B) R23.2
Net-(Q10-1): Q10.1(B) R29.2

Not connected (* = marked no-connect by the designer): U1 2(+3V3)* 3(AREF)* 10(A6) 13(QSPI_RESET)* 15(VIN)* 18(RESET)*

## Notes on the sheets
sheet 1
- COIL OUTPUT
- RED LED
- BLUE LED
- DPO
- TOYOTA1
- TOYOTA2
sheet 2
- RPM INPUT
- DPI
- ARM INPUT
- AVI
sheet 5
- Main Connector
- External Pins
- GND
